# EAGLE schematic cpu_board (EAGLE 7.1.0)
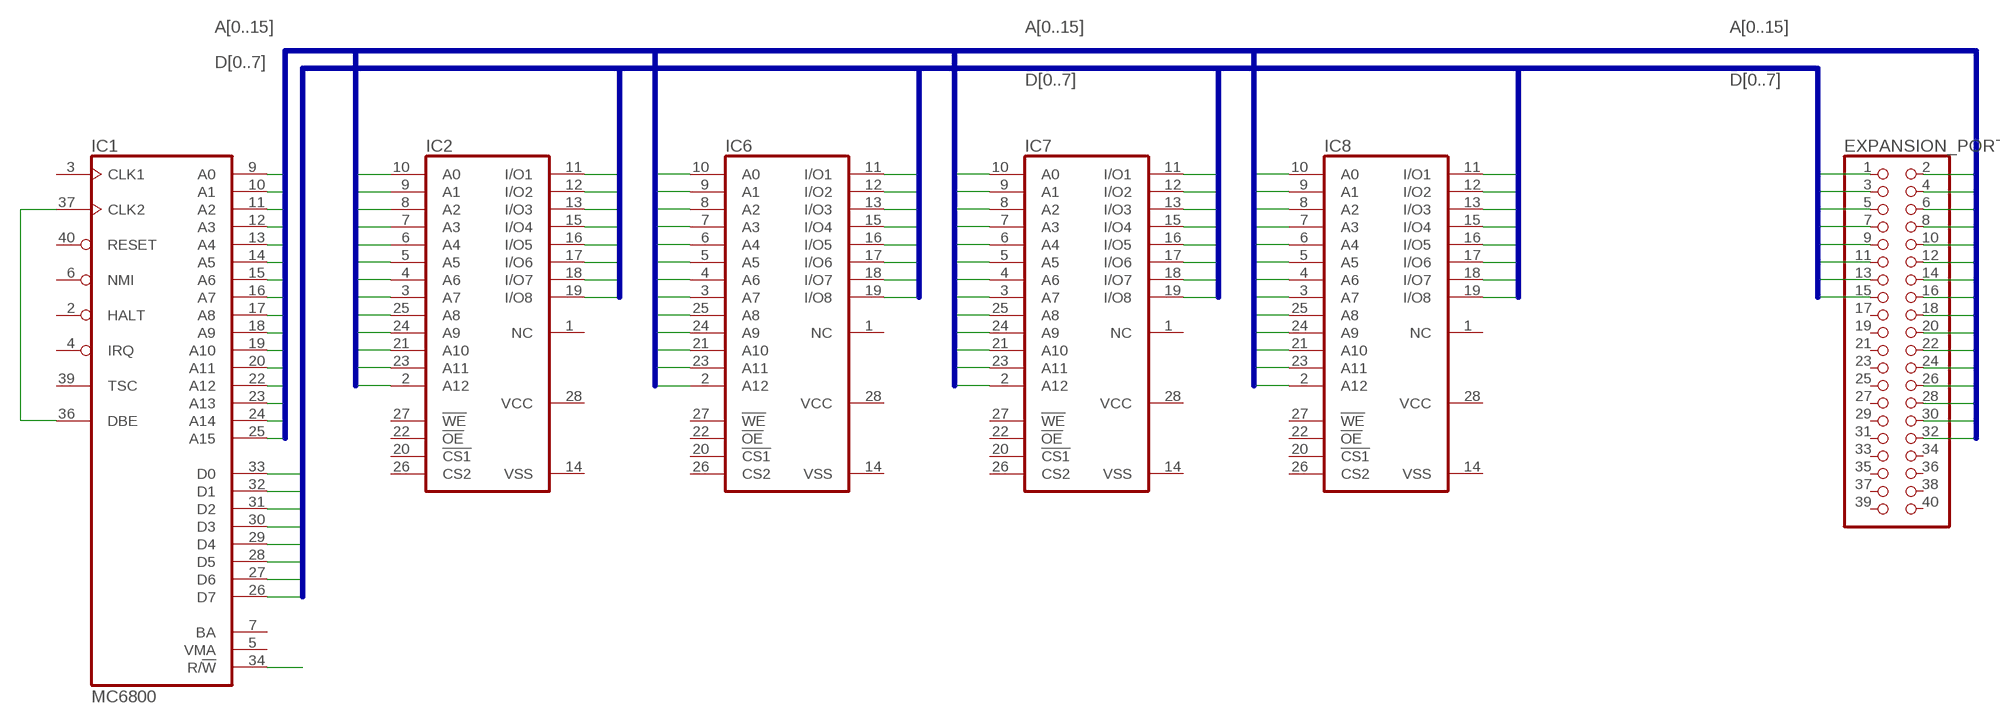
[diagram p0: schematic, sheet 1]

## Parts
EXPANSION_PORT  PINHD-2X20  [2X20]
IC1  MC6800  6800  [DIL40]
IC2  6264A  [DIL28-6]
IC6  6264A  [DIL28-6]
IC7  6264A  [DIL28-6]
IC8  6264A  [DIL28-6]

## Nets
A0: EXPANSION_PORT.2 IC1.9(A0) IC2.10(A0) IC6.10(A0) IC7.10(A0) IC8.10(A0)
A1: EXPANSION_PORT.4 IC1.10(A1) IC2.9(A1) IC6.9(A1) IC7.9(A1) IC8.9(A1)
A2: EXPANSION_PORT.6 IC1.11(A2) IC2.8(A2) IC6.8(A2) IC7.8(A2) IC8.8(A2)
A3: EXPANSION_PORT.8 IC1.12(A3) IC2.7(A3) IC6.7(A3) IC7.7(A3) IC8.7(A3)
A4: EXPANSION_PORT.10 IC1.13(A4) IC2.6(A4) IC6.6(A4) IC7.6(A4) IC8.6(A4)
A5: EXPANSION_PORT.12 IC1.14(A5) IC2.5(A5) IC6.5(A5) IC7.5(A5) IC8.5(A5)
A6: EXPANSION_PORT.14 IC1.15(A6) IC2.4(A6) IC6.4(A6) IC7.3(A7) IC7.4(A6) IC8.4(A6)
A7: EXPANSION_PORT.16 IC1.16(A7) IC2.3(A7) IC6.3(A7) IC8.3(A7)
A8: EXPANSION_PORT.18 IC1.17(A8) IC2.25(A8) IC6.25(A8) IC7.25(A8) IC8.25(A8)
A9: EXPANSION_PORT.20 IC1.18(A9) IC2.24(A9) IC6.24(A9) IC7.24(A9) IC8.24(A9)
A10: EXPANSION_PORT.22 IC1.19(A10) IC2.21(A10) IC6.21(A10) IC7.21(A10) IC8.21(A10)
A11: EXPANSION_PORT.24 IC1.20(A11) IC2.23(A11) IC6.23(A11) IC7.23(A11) IC8.23(A11)
A12: EXPANSION_PORT.26 IC1.22(A12) IC2.2(A12) IC6.2(A12) IC7.2(A12) IC8.2(A12)
A13: EXPANSION_PORT.28 IC1.23(A13)
A14: EXPANSION_PORT.30 IC1.24(A14)
A15: EXPANSION_PORT.32 IC1.25(A15)
D0: EXPANSION_PORT.1 IC1.33(D0) IC2.11(I/O1) IC6.11(I/O1) IC7.11(I/O1) IC8.11(I/O1)
D1: EXPANSION_PORT.3 IC1.32(D1) IC2.12(I/O2) IC6.12(I/O2) IC7.12(I/O2) IC8.12(I/O2)
D2: EXPANSION_PORT.5 IC1.31(D2) IC2.13(I/O3) IC6.13(I/O3) IC7.13(I/O3) IC8.13(I/O3)
D3: EXPANSION_PORT.7 IC1.30(D3) IC2.15(I/O4) IC6.15(I/O4) IC7.15(I/O4) IC8.15(I/O4)
D4: EXPANSION_PORT.9 IC1.29(D4) IC2.16(I/O5) IC6.16(I/O5) IC7.16(I/O5) IC8.16(I/O5)
D5: EXPANSION_PORT.11 IC1.28(D5) IC2.17(I/O6) IC6.17(I/O6) IC7.17(I/O6) IC8.17(I/O6)
D6: EXPANSION_PORT.13 IC1.27(D6) IC2.18(I/O7) IC6.18(I/O7) IC7.18(I/O7) IC8.18(I/O7)
D7: EXPANSION_PORT.15 IC1.26(D7) IC2.19(I/O8) IC6.19(I/O8) IC7.19(I/O8) IC8.19(I/O8)
N$2: IC1.36(DBE) IC1.37(CLK2)
N$8: IC1.34(R/!W)
Unconnected: EXPANSION_PORT.17 EXPANSION_PORT.19 EXPANSION_PORT.21 EXPANSION_PORT.23 EXPANSION_PORT.25 EXPANSION_PORT.27 EXPANSION_PORT.29 EXPANSION_PORT.31 EXPANSION_PORT.33 EXPANSION_PORT.34 EXPANSION_PORT.35 EXPANSION_PORT.36 EXPANSION_PORT.37 EXPANSION_PORT.38 EXPANSION_PORT.39 EXPANSION_PORT.40 IC1.2(HALT) IC1.3(CLK1) IC1.4(IRQ) IC1.5(VMA) IC1.6(NMI) IC1.7(BA) IC1.39(TSC) IC1.40(RESET) IC2.1(NC) IC2.20(!CS1) IC2.22(!OE) IC2.26(CS2) IC2.27(!WE) IC6.1(NC) IC6.20(!CS1) IC6.22(!OE) IC6.26(CS2) IC6.27(!WE) IC7.1(NC) IC7.20(!CS1) IC7.22(!OE) IC7.26(CS2) IC7.27(!WE) IC8.1(NC) IC8.20(!CS1) IC8.22(!OE) IC8.26(CS2) IC8.27(!WE)

## Buses
A[0..15]
D[0..7]

## Power pins joined to a net without a drawn wire
VCC: IC1.8(VCC) IC2.28(VCC) IC6.28(VCC) IC7.28(VCC) IC8.28(VCC)
VSS: IC1.1(VSS) IC1.21(VSS) IC2.14(VSS) IC6.14(VSS) IC7.14(VSS) IC8.14(VSS)

## Library data of the parts
EXPANSION_PORT = pinhead:PINHD-2X20: PIN HEADER
IC1 = micro-motorola:6800: MICROCONTROLLER/MEMORY DEVICE; MF: NTE ELECTRONICS; MPN: NTE6800; OC_FARNELL: unknown; OC_NEWARK: 31C5317
IC2 IC6-IC8 = memory-hitachi:6264A: MEMORY; OC_FARNELL: 283605; OC_NEWARK: unknown